# EAGLE schematic MotorDriver_Basic (EAGLE 9.5.2)
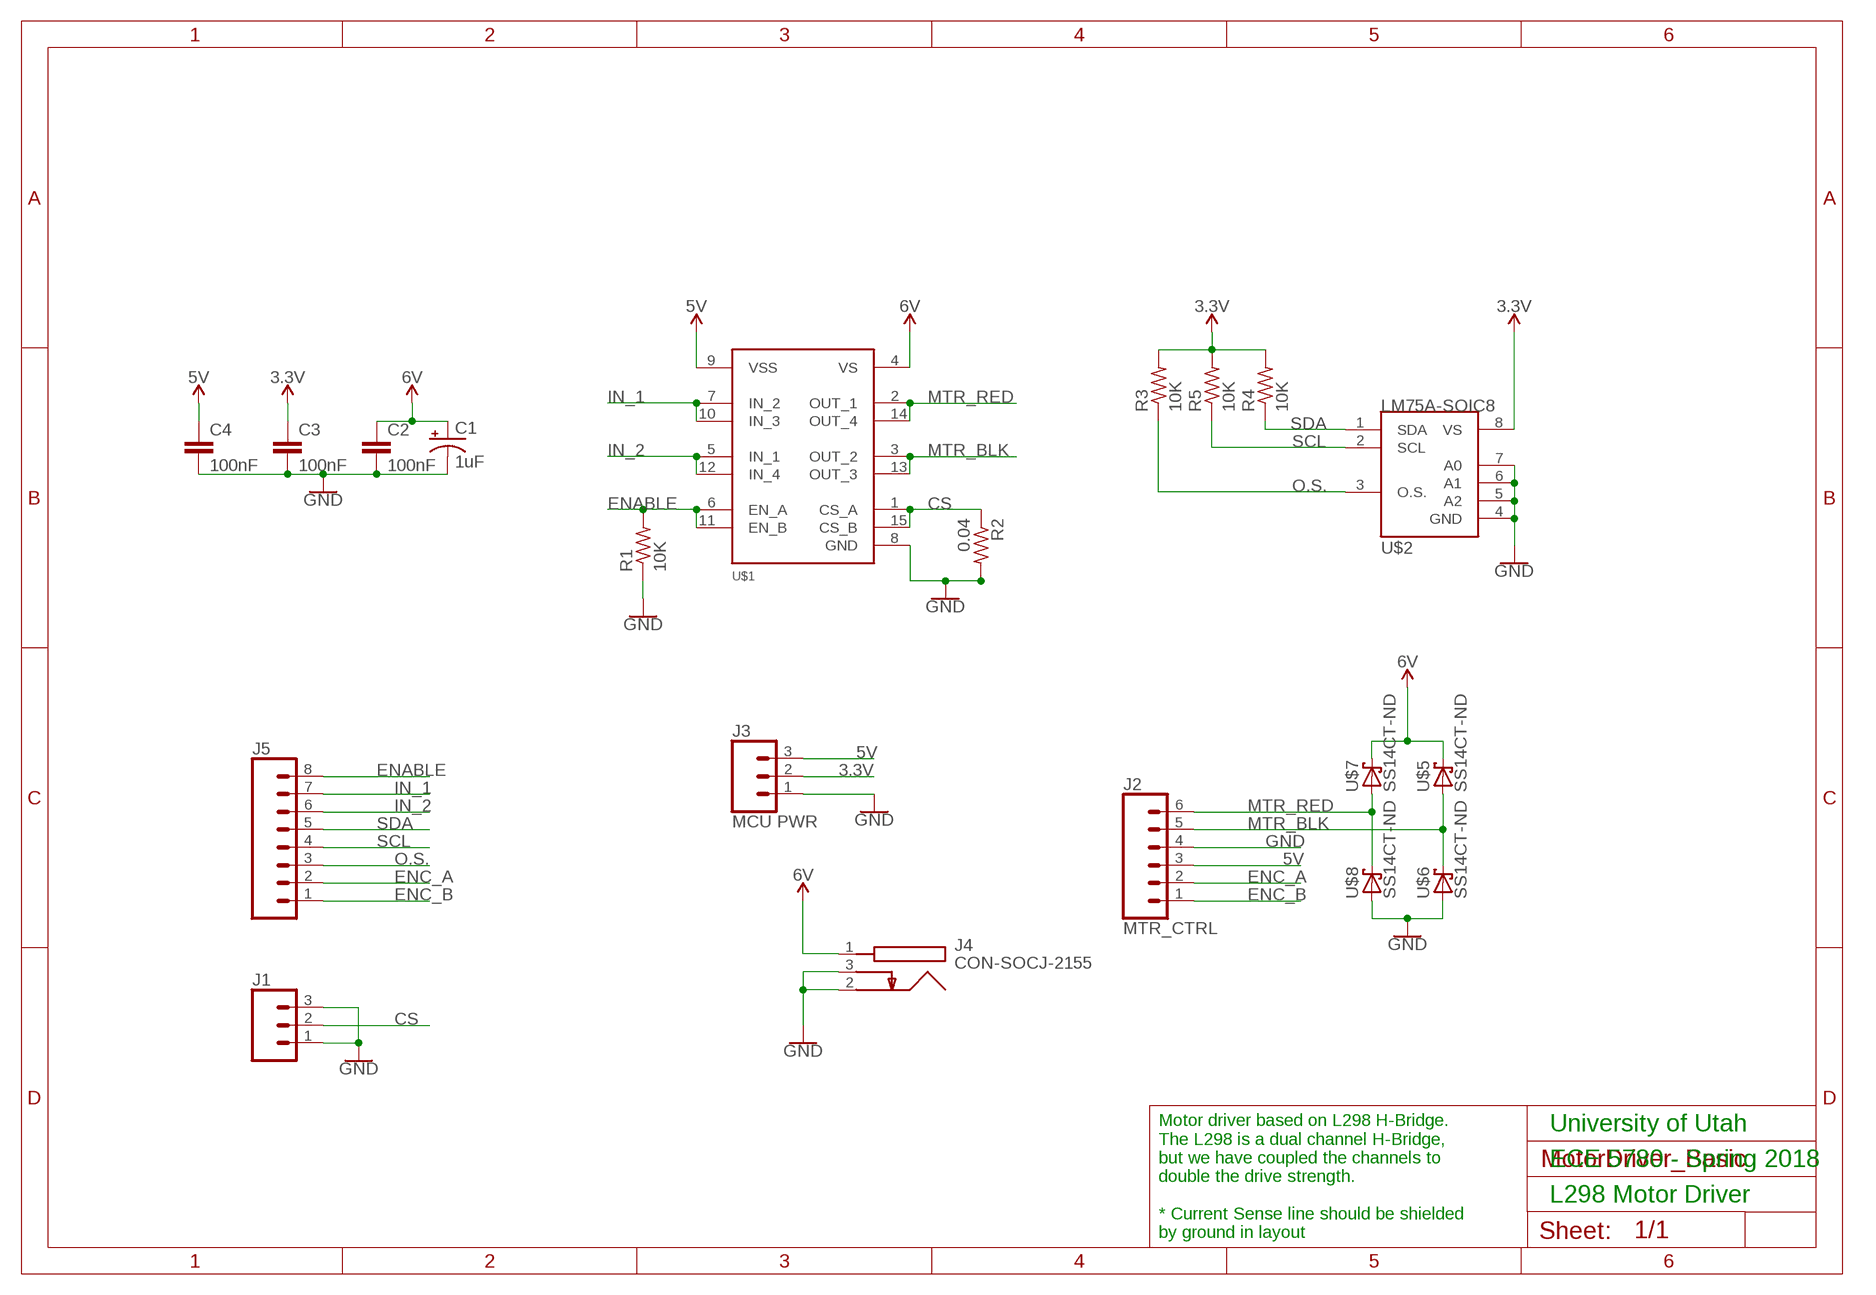
[diagram p0: schematic, sheet 1]

## Parts
C1  1uF  CPOL-USE2.5-6  [E2,5-6]
C2  100nF  C-EUC1206  [C1206]
C3  100nF  C-EUC1206  [C1206]
C4  100nF  C-EUC1206  [C1206]
J1  CONN_03  [1X03]
J2  MTR_CTRL  CONN_06SILK_FEMALE_PTH  [1X06]
J3  MCU PWR  CONN_03  [1X03]
J4  CON-SOCJ-2155  [CONSOCJ2155]
J5  CONN_08"  [1X08]
R1  10K  R-US_M1206  [M1206]
R2  0.04  R-US_M1206  [M1206]
R3  10K  R-US_M1206  [M1206]
R4  10K  R-US_M1206  [M1206]
R5  10K  R-US_M1206  [M1206]
U$1  L298N-MULTIWATT15  [L298N-MULTIWATT15]
U$2  LM75A-SOIC8  [SOIC-8]
U$5  SS14CT-ND  [SOD106A-W]
U$6  SS14CT-ND  [SOD106A-W]
U$7  SS14CT-ND  [SOD106A-W]
U$8  SS14CT-ND  [SOD106A-W]

## Nets
3.3V: C3.1 J3.2 R3.2 R4.2 R5.2 U$2.8(VS)
5V: C4.1 J2.3 J3.3 U$1.9(VSS)
CS: J1.2 R2.1 U$1.1(CS_A) U$1.15(CS_B)
ENABLE: J5.8 R1.2 U$1.6(EN_A) U$1.11(EN_B)
ENC_A: J2.2 J5.2
ENC_B: J2.1 J5.1
GND: C1.- C2.2 C3.2 C4.2 J1.1 J1.3 J2.4 J3.1 J4.2 J4.3 R1.1 R2.2 U$1.8(GND) U$2.4(GND) U$2.5(A2) U$2.6(A1) U$2.7(A0) U$6.A U$8.A
IN_1: J5.7 U$1.7(IN_2) U$1.10(IN_3)
IN_2: J5.6 U$1.5(IN_1) U$1.12(IN_4)
MTR_BLK: J2.5 U$1.3(OUT_2) U$1.13(OUT_3) U$5.A U$6.C
MTR_RED: J2.6 U$1.2(OUT_1) U$1.14(OUT_4) U$7.A U$8.C
O.S.: J5.3 R3.1 U$2.3(O.S.)
SCL: J5.4 R5.1 U$2.2(SCL)
SDA: J5.5 R4.1 U$2.1(SDA)
VCC: C1.+ C2.1 J4.1 U$1.4(VS) U$5.C U$7.C ; supply symbol labelled 6V

## Notes on the sheet
- University of Utah
- ECE 5780 - Spring 2018
- L298 Motor Driver
- Motor driver based on L298 H-Bridge. 
  The L298 is a dual channel H-Bridge, 
  but we have coupled the channels to 
  double the drive strength. 
  
  * Current Sense line should be shielded 
  by ground in layout

## Library data of the parts
C1 = rcl:CPOL-US: POLARIZED CAPACITOR, American symbol; SPICEPREFIX: C
C2-C4 = rcl:C-EU: CAPACITOR, European symbol; SPICEPREFIX: C
J1 J3 = SparkFun-Connectors:CONN_03: Multi connection point. Often used as Generic Header-pin footprint for 0.1 inch spaced/style header connections On any of the 0.1 inch spaced packages, you can populate with these: Break Away Headers - Straight <https://www.sparkfun.com/products/116> (PRT-00116) Break Away Male Headers - Right Angle <https://www.sparkfun.com/products/553> (PRT-00553) Female Headers <https://www.sparkfun.com/products/115> (PRT-00115) Break Away Headers - Machine Pin <https://www.sparkfun.com/products/117> (PRT-00117) Break Away Female Headers - Swiss Machine Pin <https://www.sparkfun.com/products/743> (PRT-00743) Stackable Header - 3 Pin (Female, 0.1") <https://www.sparkfun.com/products/13875> (PRT-13875) For SCREWTERMINALS and SPRING TERMINALS visit here: Screw Terimnals on SparkFun.com <https://www.sparkfun.com/search/results?term=Screw+Terminals> (5mm/3.5mm/2.54mm spacing) This device is also useful as a general connection point to wire up your design to another part of your project. Our various solder wires solder well into these plated through hole pads. Hook-Up Wire - Assortment (Stranded, 22 AWG) <https://www.sparkfun.com/products/11375> (PRT-11375) Hook-Up Wire - Assortment (Solid Core, 22 AWG) <https://www.sparkfun.com/products/11367> (PRT-11367) View the entire wire category on our website here <https://www.sparkfun.com/categories/141> Special notes: Molex polarized connector foot print use with SKU : PRT-08232 with associated crimp pins and housings.
J2 = SparkFun-Connectors:CONN_06: Multi connection point. Often used as Generic Header-pin footprint for 0.1 inch spaced/style header connections On any of the 0.1 inch spaced packages, you can populate with these: Break Away Headers - Straight <https://www.sparkfun.com/products/116> (PRT-00116) Break Away Male Headers - Right Angle <https://www.sparkfun.com/products/553> (PRT-00553) Female Headers <https://www.sparkfun.com/products/115> (PRT-00115) Break Away Headers - Machine Pin <https://www.sparkfun.com/products/117> (PRT-00117) Break Away Female Headers - Swiss Machine Pin <https://www.sparkfun.com/products/743> (PRT-00743) Arduino Stackable Header - 6 Pin <https://www.sparkfun.com/products/9280> (PRT-09280) For SCREWTERMINALS and SPRING TERMINALS visit here: Screw Terimnals on SparkFun.com <https://www.sparkfun.com/search/results?term=Screw+Terminals> (5mm/3.5mm/2.54mm spacing) This device is also useful as a general connection point to wire up your design to another part of your project. Our various solder wires solder well into these plated through hole pads. Hook-Up Wire - Assortment (Stranded, 22 AWG) <https://www.sparkfun.com/products/11375> (PRT-11375) Hook-Up Wire - Assortment (Solid Core, 22 AWG) <https://www.sparkfun.com/products/11367> (PRT-11367) View the entire wire category on our website here <https://www.sparkfun.com/categories/141>; PROD_ID: CONN-08437
J4 = SamacSys_Parts:CON-SOCJ-2155: DC Power Connectors Power Jack/Connector 2.1mm x 5.5mm Source: Datasheet <http://www.produktinfo.conrad.com/datenblaetter/1500000-1599999/001582350-da-01-en-DC_EINBAUBUCHSE__SCHALTER_GESCHLOSSEN.pdf>; DESCRIPTION: DC Power Connectors Power Jack/Connector 2.1mm x 5.5mm; HEIGHT: 11mm; MANUFACTURER_NAME: Gravitech; MANUFACTURER_PART_NUMBER: CON-SOCJ-2155; MOUSER_PART_NUMBER: 992-CON-SOCJ-2155; MOUSER_PRICE-STOCK: https://www.mouser.co.uk/ProductDetail/Gravitech/CON-SOCJ-2155/?qs=fkzBJ5HM%252BdCcpvFQyQZHtA%3D%3D
J5 = SparkFun-Connectors:CONN_08: Multi connection point. Often used as Generic Header-pin footprint for 0.1 inch spaced/style header connections On any of the 0.1 inch spaced packages, you can populate with these: Break Away Headers - Straight <https://www.sparkfun.com/products/116> (PRT-00116) Break Away Male Headers - Right Angle <https://www.sparkfun.com/products/553> (PRT-00553) Female Headers <https://www.sparkfun.com/products/115> (PRT-00115) Break Away Headers - Machine Pin <https://www.sparkfun.com/products/117> (PRT-00117) Break Away Female Headers - Swiss Machine Pin <https://www.sparkfun.com/products/743> (PRT-00743) Arduino Stackable Header - 8 Pin <https://www.sparkfun.com/products/9279> (PRT-09279) For SCREWTERMINALS and SPRING TERMINALS visit here: Screw Terimnals on SparkFun.com <https://www.sparkfun.com/search/results?term=Screw+Terminals> (5mm/3.5mm/2.54mm spacing) This device is also useful as a general connection point to wire up your design to another part of your project. Our various solder wires solder well into these plated through hole pads. Hook-Up Wire - Assortment (Stranded, 22 AWG) <https://www.sparkfun.com/products/11375> (PRT-11375) Hook-Up Wire - Assortment (Solid Core, 22 AWG) <https://www.sparkfun.com/products/11367> (PRT-11367) View the entire wire category on our website here <https://www.sparkfun.com/categories/141> Special notes: Molex polarized connector foot print use with SKU : PRT-08231 with associated crimp pins and housings. 1MM SMD Version SKU: PRT-10208 NOTES ON THE VARIANTS LOCK and LOCK_LONGPADS... This footprint was designed to help hold the alignment of a through-hole component (i.e. 6-pin header) while soldering it into place. You may notice that each hole has been shifted either up or down by 0.005 of an inch from it's more standard position (which is a perfectly straight line). This slight alteration caused the pins (the squares in the middle) to touch the edges of the holes. Because they are alternating, it causes a "brace" to hold the component in place. 0.005 has proven to be the perfect amount of "off-center" position when using our standard breakaway headers. Although looks a little odd when you look at the bare footprint, once you have a header in there, the alteration is very hard to notice. Also,if you push a header all the way into place, it is covered up entirely on the bottom side.; PROD_ID: CONN-08438
R1-R5 = rcl:R-US_: RESISTOR, American symbol; SPICEPREFIX: R
U$1 = ECE5780-MotorDriver:L298N-MULTIWATT15
U$2 = L298_Motor_Driver_Lib_ECE5780:LM75A-SOIC8
U$5-U$8 = L298_Motor_Driver_Lib_ECE5780:SS14CT-ND: Schottky Diode: SS14CT-ND, 40V, 1A, DO-214AC, SMA